# Altium project amc.PrjPcb
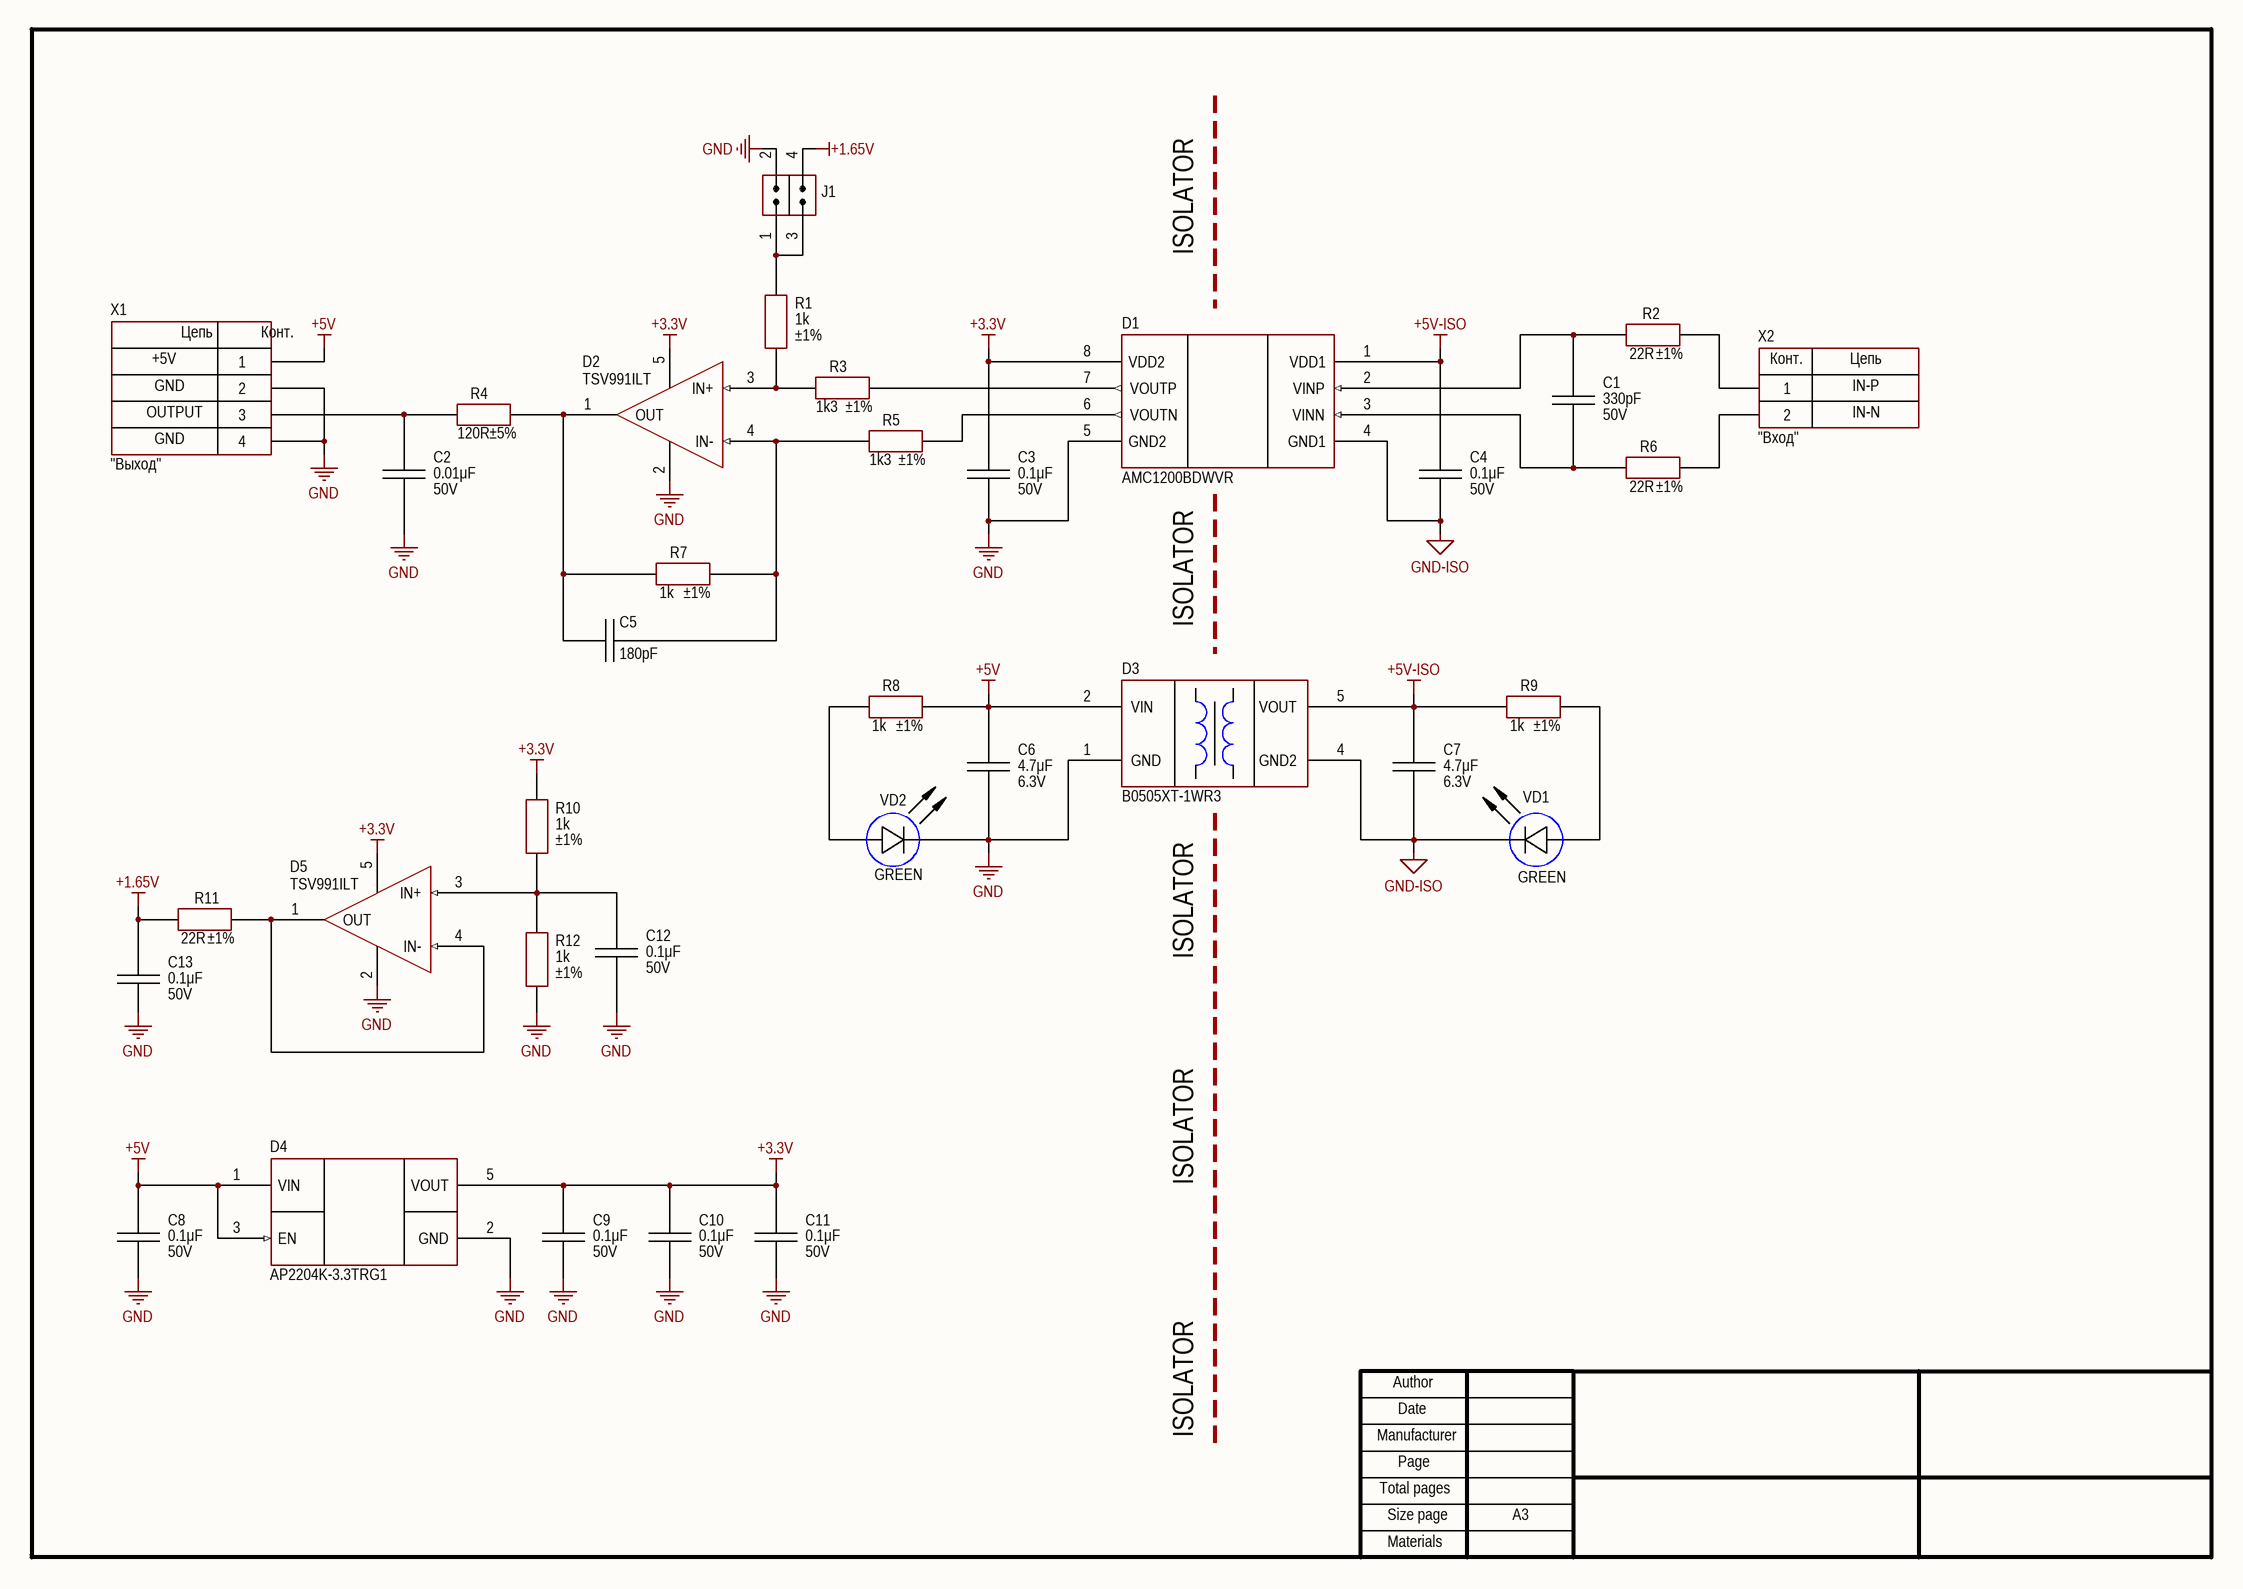
[diagram p0: isolator-amplifier.SchDoc]
1 sheet, 35 parts. Net scope: global (net labels, ports and power ports of the same name join across sheets).
Board file: pcb.PcbDoc

## Sheet isolator-amplifier.SchDoc
size 420 x 297 mm; Address1: Address1; Address2: Address2; Address3: Address3; Address4: Address4; DocumentNumber: АБВГ.123456.001 Э3; SheetNumber: 1; Scale: 1:1; DocumentType: Схема электрическая принципиальная; FirstReferrence: АБВГ.123456.001

### Parts
C1  value 330pF  Voltage: 50V  [CAP: 0603]
C2  value 0.01μF  Voltage: 50V  [CAP: 0603]
C3  value 0.1μF  Voltage: 50V  [CAP: 0603]
C4  value 0.1μF  Voltage: 50V  [CAP: 0603]
C5  value 180pF  [CAP: 0603]
C6  value 4.7μF  Voltage: 6.3V  [CAP: 0603]
C7  value 4.7μF  Voltage: 6.3V  [CAP: 0603]
C8  value 0.1μF  Voltage: 50V  [CAP: 0603]
C9  value 0.1μF  Voltage: 50V  [CAP: 0603]
C10  value 0.1μF  Voltage: 50V  [CAP: 0603]
C11  value 0.1μF  Voltage: 50V  [CAP: 0603]
C12  value 0.1μF  Voltage: 50V  [CAP: 0603]
C13  value 0.1μF  Voltage: 50V  [CAP: 0603]
D1  (no value)  [8-SOIC-W]
D2  (no value)  [SOT23-5]
D3  (no value)  [MOD: B0505XT-1WR3]
D4  (no value)  [SOT23-5]
D5  (no value)  [SOT23-5]
J1  (no value)  [CON: JUMPER x2]
R1  value 1k  Tolerance: ±1%  [RES: 0603]
R2  value 22R  Tolerance: ±1%  [RES: 0603]
R3  value 1k3  Tolerance: ±1%  [RES: 0603]
R4  value 120R  Tolerance: ±5%  [RES: 0603]
R5  value 1k3  Tolerance: ±1%  [RES: 0603]
R6  value 22R  Tolerance: ±1%  [RES: 0603]
R7  value 1k  Tolerance: ±1%  [RES: 0603]
R8  value 1k  Tolerance: ±1%  [RES: 0603]
R9  value 1k  Tolerance: ±1%  [RES: 0603]
R10  value 1k  Tolerance: ±1%  [RES: 0603]
R11  value 22R  Tolerance: ±1%  [RES: 0603]
R12  value 1k  Tolerance: ±1%  [RES: 0603]
VD1  Color: GREEN  [LED: 0603G]
VD2  Color: GREEN  [LED: 0603G]
X1  CommentText: "Выход"  [CON: CWF-4R]
X2  CommentText: "Вход"  [CON: CWF-2R]

### Nets
+1.65V: C13.2 J1.4(IN) R11.1
+3.3V: C3.2 C9.2 C10.2 C11.2 D1.8(VDD2) D2.5(V+) D4.5(VOUT) D5.5(V+) R10.2
+5V: C6.2 C8.2 D3.2(VIN) D4.1(VIN) D4.3(EN) R8.2 X1.1
+5V-ISO: C4.2 C7.2 D1.1(VDD1) D3.5(VOUT) R9.1
GND: C2.1 C3.1 C6.1 C8.1 C9.1 C10.1 C11.1 C12.1 C13.1 D1.5(GND2) D2.2(V-) D3.1(GND) D4.2(GND) D5.2(V-) J1.2(IN) R12.1 VD2.2(C) X1.2 X1.4
GND-ISO: C4.1 C7.1 D1.4(GND1) D3.4(GND2) VD1.2(C)
NetC1_1: C1.1 D1.3(VINN) R6.1
NetC1_2: C1.2 D1.2(VINP) R2.1
NetC2_2: C2.2 R4.1 X1.3
NetC5_1: C5.1 D2.4(IN-) R5.1 R7.2
NetC5_2: C5.2 D2.1(OUT) R4.2 R7.1
NetC12_2: C12.2 D5.3(IN+) R10.1 R12.2
NetD1_6: D1.6(VOUTN) R5.2
NetD1_7: D1.7(VOUTP) R3.2
NetD2_3: D2.3(IN+) R1.1 R3.1
NetD5_1: D5.1(OUT) D5.4(IN-) R11.2
NetJ1_1: J1.1(IN) J1.3(IN) R1.2
NetR2_2: R2.2 X2.1
NetR6_2: R6.2 X2.2
NetR8_1: R8.1 VD2.1(A)
NetR9_2: R9.2 VD1.1(A)

### Notes on the sheet
- ISOLATOR
- +5V
- GND
- IN-P
- OUTPUT
- IN-N
- Author
- Manufacturer
- Date
- Page
- Total pages
- Size page
- A3
- Materials
- (in symbol CWF-2) Конт.; Цепь
- (in symbol CWF-4) Цепь; Конт.

### Library data of the parts
C1 = Ceramic_0603: Manufacturer: Samsung; PartNumber: CL10C331JB8NNNC; ValueManufacturerPartNumber: Ceramic capacitor, 330pF, NPO, ±10%, 50V, 0603, -55...+125°C; TypeCapacitor: Ceramic capacitor; Tolerance: ±10%; TypeDielectric: NPO; Package: 0603; HelpURL: https://www.digikey.com/product-detail/en/samsung-electro-mechanics/CL10C331JB8NNNC/1276-1073-1-ND/3889159; Temperature: -55...+125°C
C2 = Ceramic_0603: Manufacturer: Samsung; PartNumber: CL10B103KB8NNNC; ValueManufacturerPartNumber: Ceramic capacitor, 0.01μF, X7R, ±10%, 50V, 0603, -55...+125°C; TypeCapacitor: Ceramic capacitor; Tolerance: ±10%; TypeDielectric: X7R; Package: 0603; HelpURL: https://www.digikey.com/product-detail/en/samsung-electro-mechanics/CL10B103KB8NNNC/1276-1009-1-ND/3889095; Temperature: -55...+125°C
C3 C4 C8-C13 = Ceramic_0603: Manufacturer: Samsung; PartNumber: CL10B104KB8WPND; ValueManufacturerPartNumber: Ceramic capacitor, 0.1μF, X7R, ±10%, 50V, 0603, -55...+125°C; TypeCapacitor: Ceramic capacitor; Tolerance: ±10%; TypeDielectric: X7R; Package: 0603; HelpURL: https://www.digikey.com/product-detail/en/samsung-electro-mechanics/CL10B104KB8WPND/1276-CL10B104KB8WPNDCT-ND/11488014; Temperature: -55...+125°C
C5 = Ceramic_0603: Manufacturer: Samsung; PartNumber: CL10C181JB8NNNC; ValueManufacturerPartNumber: Ceramic capacitor, 180pF, NPO, ±5%, 50V, 0603, -55...+125°C; TypeCapacitor: Ceramic capacitor; Tolerance: ±5%; TypeDielectric: NPO; Voltage: 50V; Package: 0603; HelpURL: https://www.digikey.com/en/products/detail/samsung-electro-mechanics/CL10C181JB8NNNC/3886913; Temperature: -55...+125°C
C6 C7 = Ceramic_0603: Manufacturer: Samsung; PartNumber: CL10B475KQ8NQNC; ValueManufacturerPartNumber: Ceramic capacitor, 4.7μF, X7R, ±10%, 6.3V, 0603, -55...+125°C; TypeCapacitor: Ceramic capacitor; Tolerance: ±10%; TypeDielectric: X7R; Package: 0603; HelpURL: https://www.digikey.com/en/products/detail/samsung-electro-mechanics/CL10B475KQ8NQNC/3887745; Temperature: -55...+125°C
D1 = AMC1200BDWVR: Isolator amplifier; Manufacturer: Texas Instruments; ValueManufacturerPartNumber: IC isolator amplifier, Differential, 100 kHz, 2.7...5.5V, -40...+105°C, 8-SOIC; Supply: 2.7...5.5V; OutputType: Differential; GainBandwidth: 100 kHz; HelpURL: https://www.digikey.com/product-detail/en/texas-instruments/AMC1200BDWVR/296-39898-1-ND/5177775; Package: 8-SOIC; ComponentType: IC isolator amplifier; Temperature: -40...+105°C; PartNumber: AMC1200BDWVR
D2 D5 = TSV991ILT: OP amplifier; Manufacturer: STMicroelectronics; ValueManufacturerPartNumber: IC op amplifier, Rail-to-Rail, 20 MHz, 2.7...5.5V, -40...+125°C, SOT23-5; Supply: 2.7...5.5V; OutputType: Rail-to-Rail; GainBandwidth: 20 MHz; HelpURL: https://www.digikey.com/product-detail/en/stmicroelectronics/TSV991ILT/497-6001-1-ND/1578484; Package: SOT23-5; ComponentType: IC op amplifier; Temperature: -40...+125°C; PartNumber: TSV991ILT
D3 = B0505XT-1WR3: DC/DC converter; Manufacturer: Mornsun; ValueManufacturerPartNumber: DC/DC converter, isolator, 5V 200mA, -40...+105°C, SMD-8; OutputType: isolator; OutputVoltage: 5V 200mA; HelpURL: https://www.mornsun-power.com/html/products/35/0.25-3w-smd.html; Package: SMD-8; ComponentType: DC/DC converter; Temperature: -40...+105°C; PartNumber: B0505XT-1WR3
D4 = AP2204K-3.3TRG1: Linear voltage regulator; Manufacturer: Diodes Incorporated; ValueManufacturerPartNumber: Linear voltage regulator, input 4...24V, 0.5V, output 3.3V, 0.15A, -40...+85°C, SOT23-6; VoltageInput: input 4...24V; MaxDropout: 0.5V; CurrentOutput: 0.15A; VoltageOutput: output 3.3V; HelpURL: https://www.digikey.com/product-detail/en/diodes-incorporated/AP2204K-3.3TRG1/AP2204K-3.3TRG1DICT-ND/4505288; Package: SOT23-6; ComponentType: Linear voltage regulator; Temperature: -40...+85°C; PartNumber: AP2204K-3.3TRG1
J1 = Jumper_double: CommentText: "Перемычка"
R1 R7-R10 R12 = Resistor_0603: Manufacturer: Yageo; PartNumber: RC0603FR-071KL; ValueManufacturerPartNumber: Resistor film, 1k, ±1%, 0603, 0.1W, -55...+125°C; TypeResistor: Resistor film; Power: 0.1W; Package: 0603; HelpURL: https://www.digikey.com/product-detail/en/yageo/RC0603FR-071KL/311-1-00KHRCT-ND/729790; Temperature: -55...+125°C
R2 R6 R11 = Resistor_0603: Manufacturer: Yageo; PartNumber: RC0603FR-0722RL; ValueManufacturerPartNumber: Resistor film, 22R, ±1%, 0603, 0.1W, -55...+125°C; TypeResistor: Resistor film; Power: 0.1W; Package: 0603; HelpURL: https://www.digikey.com/product-detail/en/yageo/RC0603FR-0722RL/311-22-0HRCT-ND/730002; Temperature: -55...+125°C
R3 R5 = Resistor_0603: Manufacturer: Yageo; PartNumber: RC0603FR-071K3L; ValueManufacturerPartNumber: Resistor film, 1k3, ±1%, 0603, 0.1W, -55...+125°C; TypeResistor: Resistor film; Power: 0.1W; Package: 0603; HelpURL: https://www.digikey.com/product-detail/en/yageo/RC0603FR-071K3L/311-1-30KHRCT-ND/729805; Temperature: -55...+125°C
R4 = Resistor_0603: Manufacturer: Yageo; PartNumber: RC0603JR-07120RL; ValueManufacturerPartNumber: Resistor film, 120R, ±5%, 0603, 0.1W, -55...+125°C; TypeResistor: Resistor film; Power: 0.1W; Package: 0603; HelpURL: https://www.digikey.com/product-detail/en/yageo/RC0603JR-07120RL/311-120GRCT-ND/729653; Temperature: -55...+125°C
VD1 VD2 = LED_single: Manufacturer: Wurth; ValueManufacturerPartNumber: LED, 20mA, 2V, 0603, -55...+150°C; PartNumber: 150060VS75000; TypeDiode: LED; Current: 20mA; VoltageDrop: 2V; Package: 0603; HelpURL: https://www.digikey.com/product-detail/en/w-rth-elektronik/150060VS75000/732-4980-1-ND/4489904; Temperature: -55...+150°C
X1 = CWF-4: Manufacturer: Connfly; ValueManufacturerPartNumber: Connector, 4pin, 2.54mm, 250VAC, 3A; PartNumber: CWF-4R; TypeConnector: Connector; VoltageMax: 250VAC; Pitch: 2.54mm; CurrentMax: 3A; Multichannel: 4pin; HelpURL: https://www.chipdip.ru/product/cwf-4r-ds1069-4-mr
X2 = CWF-2: Manufacturer: Connfly; ValueManufacturerPartNumber: Connector, 2pin, 2.54mm, 250VAC, 3A; PartNumber: CWF-2R; TypeConnector: Connector; VoltageMax: 250VAC; Pitch: 2.54mm; CurrentMax: 3A; Multichannel: 2pin; HelpURL: https://www.chipdip.ru/product/cwf-2r-ds1069-2-mr